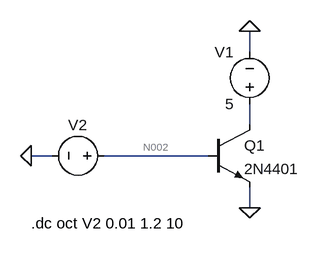
[diagram p0: schematic Eingangskennlinie.asc]
Eingangskennlinie.asc, the LTspice schematic file:
Version 4.1
SHEET 1 880 680
WIRE 384 0 384 -32
WIRE 384 112 384 80
WIRE 80 160 48 160
WIRE 320 160 160 160
WIRE 384 240 384 208
FLAG 384 -32 0
FLAG 384 240 0
FLAG 48 160 0
SYMBOL npn 320 112 R0
SYMATTR InstName Q1
SYMATTR Value 2N4401
SYMBOL voltage 384 96 R180
WINDOW 0 24 96 Left 2
WINDOW 3 24 16 Left 2
WINDOW 123 0 0 Left 0
WINDOW 39 0 0 Left 0
SYMATTR InstName V1
SYMATTR Value 5
SYMBOL voltage 176 160 R90
WINDOW 0 -32 56 VBottom 2
WINDOW 3 32 56 VTop 2
WINDOW 123 0 0 Left 0
WINDOW 39 0 0 Left 0
SYMATTR InstName V2
SYMATTR Value ""
TEXT 48 264 Left 2 !.dc oct V2 0.01 1.2 10

The netlist it stands for:
* Eingangskennlinie.asc
Q1 N001 N002 0 0 2N4401
V1 N001 0 5
V2 N002 0
.model NPN NPN
.model PNP PNP
.lib standard.bjt
.dc oct V2 0.01 1.2 10
.backanno
.end

* Results of the author's LTspice run, read from the files saved beside the schematic
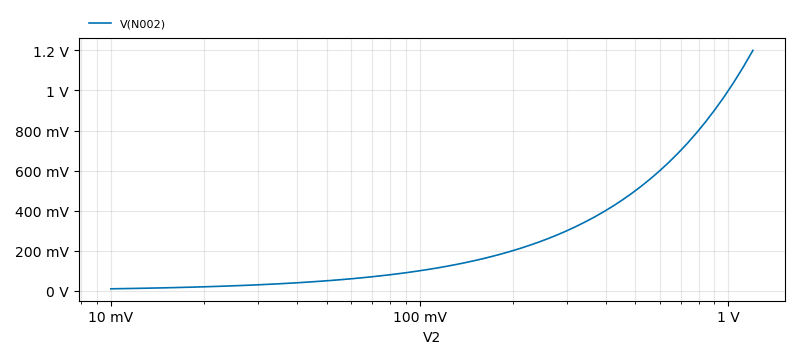
[diagram p1: DC transfer characteristic of Eingangskennlinie.asc, plotted from the saved traces]
* DC transfer characteristic, 1 run:
*   V(N002): 10 mV at V2=10 mV, 1.2 V at V2=1.2 V, min 10 mV, max 1.2 V